# EAGLE design 2022-07-29 LVMi Pressure Sensor - 1624 (EAGLE 9.6.2)
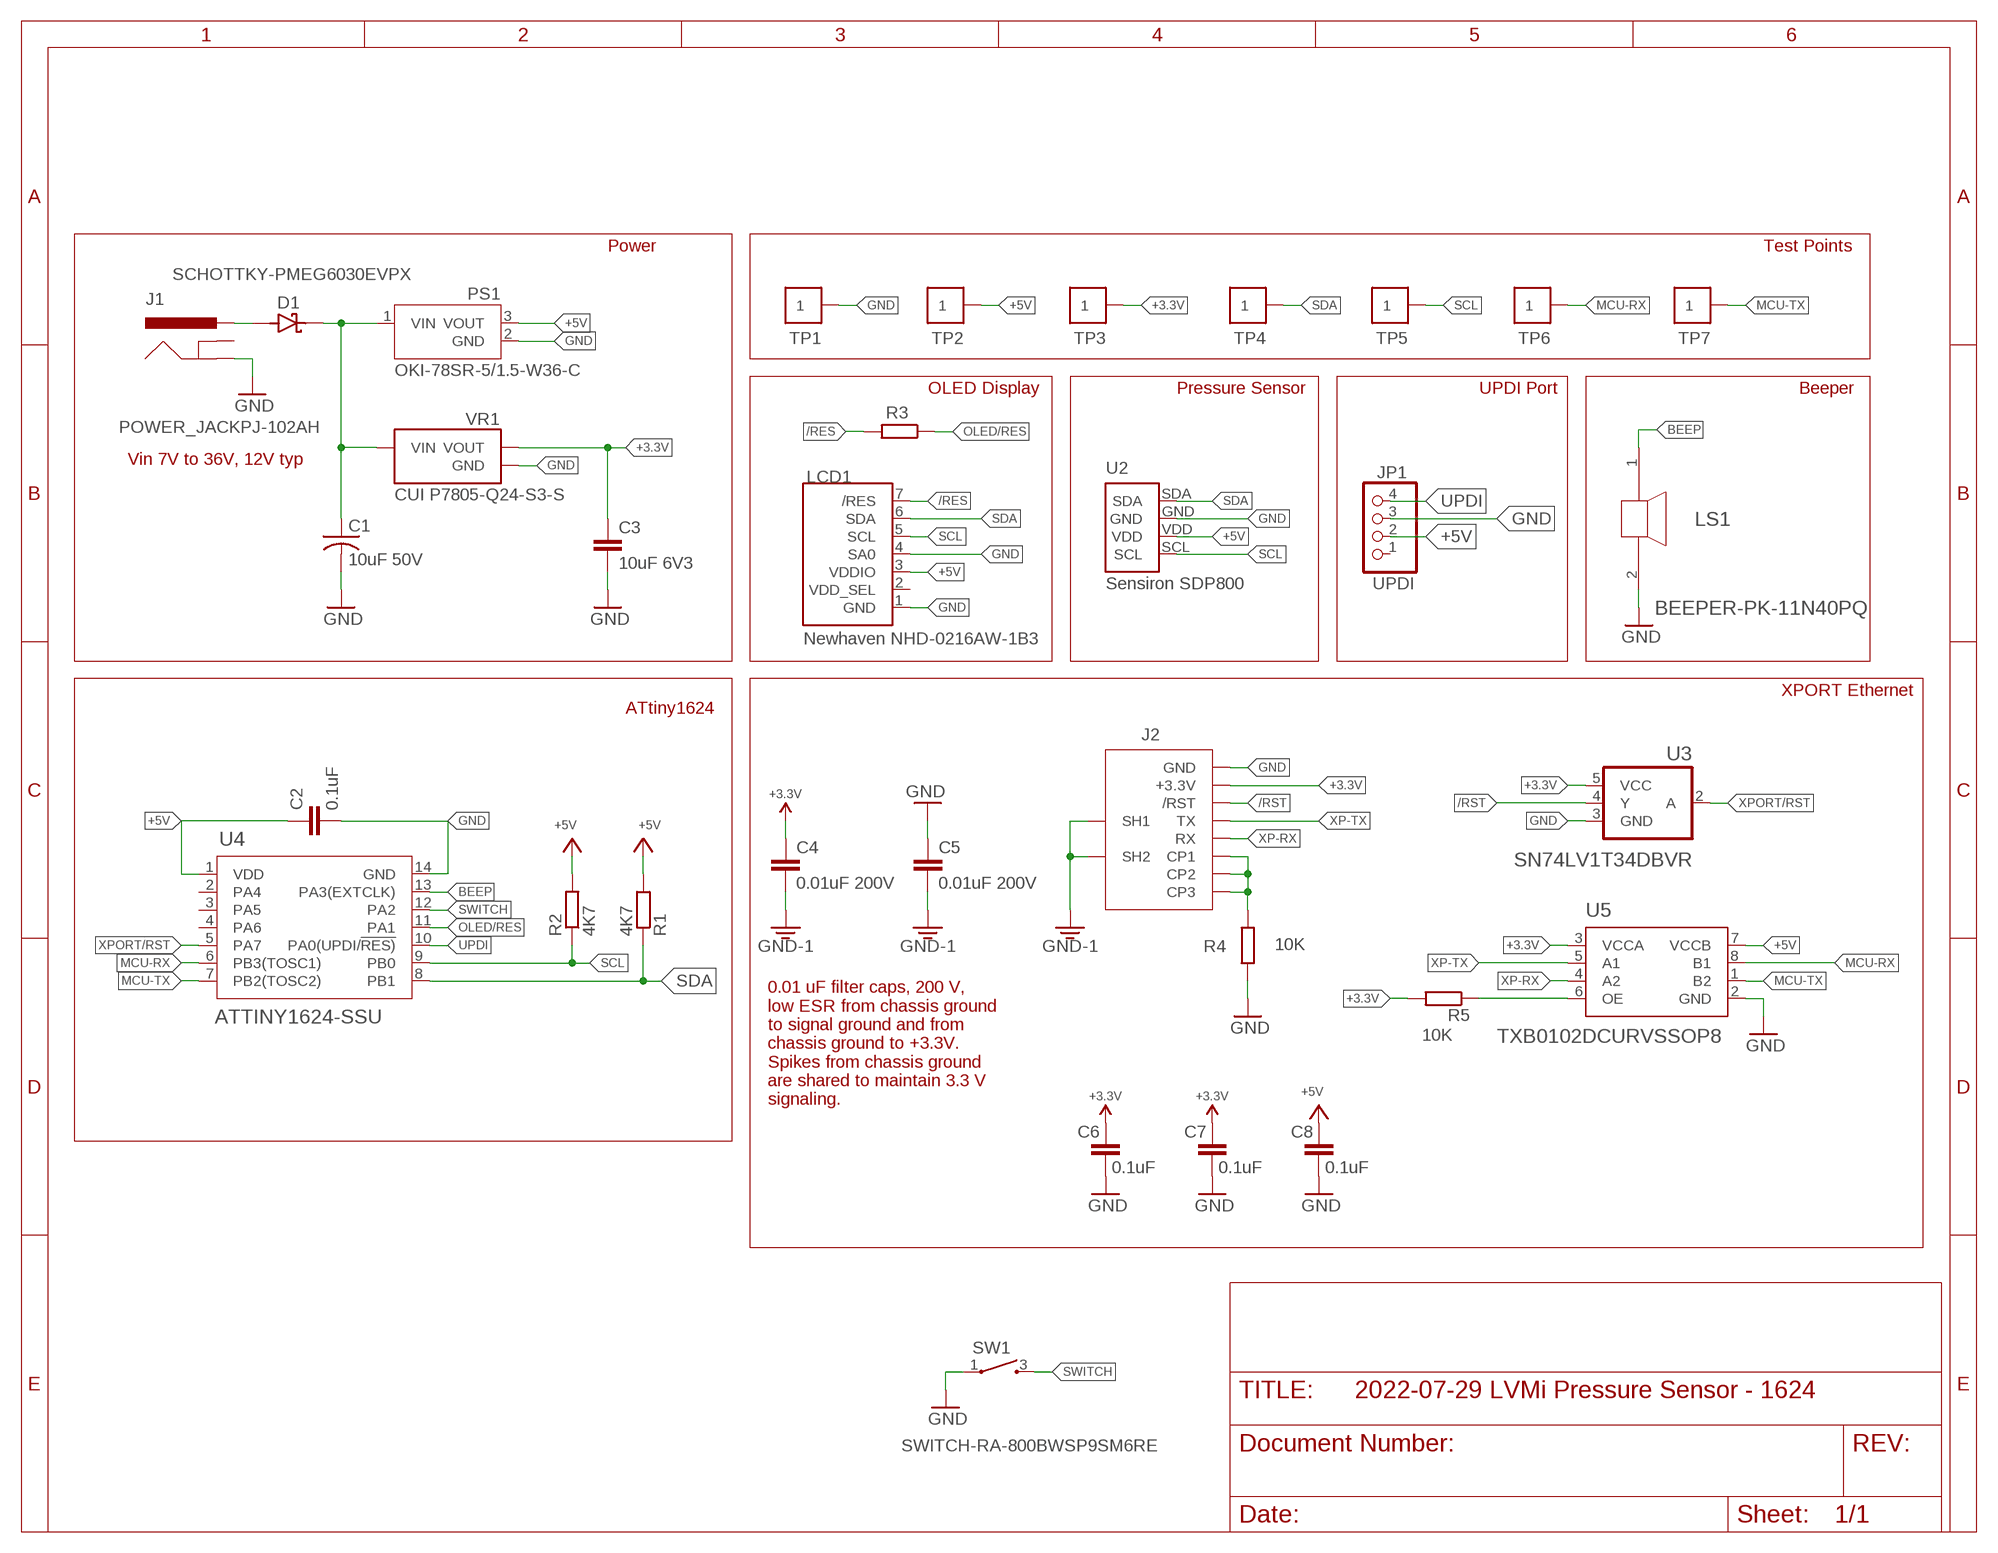
[diagram p0: schematic, sheet 1]

## Parts
C1  10uF 50V  C-USC1210  [C1210]
C2  0.1uF  C-EUC0805  [C0805]
C3  10uF 6V3  C-EUC0805  [C0805]
C4  0.01uF 200V  C-EUC0805  [C0805]
C5  0.01uF 200V  C-EUC0805  [C0805]
C6  0.1uF  C-EUC0805  [C0805]
C7  0.1uF  C-EUC0805  [C0805]
C8  0.1uF  C-EUC0805  [C0805]
D1  SCHOTTKY-PMEG6030EVPX  [DIO_PMEG6030EVPX]
J1  POWER_JACKPJ-102AH  [PJ-102AH]
J2  XPORTXPORT-2  [XPORT-2]
JP1  UPDI  PINHD-1X4/90  [1X04/90]
LCD1  Newhaven NHD-0216AW-1B3  LCD-NEWHAVEN-16X2  [LCD-NEWHAVEN-16X2]
LS1  BEEPER-PK-11N40PQ  [PK-11N40PQ_MAL]
PS1  OKI-78SR-5/1.5-W36-C  [CONV_OKI-78SR-5/1.5-W36-C]
R1  4K7  R-EU_R0805  [R0805]
R2  4K7  R-EU_R0805  [R0805]
R3  R-EU_R0805  [R0805]
R4  10K  R-EU_R0805  [R0805]
R5  10K  R-EU_R0805  [R0805]
SW1  SWITCH-RA-800BWSP9SM6RE  [SWITCH-RA-800BWSP9SM6RE]
TP1  GND  TP5000-TESTPOINT-BLK  [TP5000-TESTPOINT-BLK]
TP2  +5V  TP5000-TESTPOINT-RED  [TP5000-TESTPOINT-RED]
TP3  +3.3V  TP5000-TESTPOINT-PUR  [TP5000-TESTPOINT-PUR]
TP4  SDA  TP5000-TESTPOINT-YEL  [TP5000-TESTPOINT-YEL]
TP5  SCL  TP5000-TESTPOINT-WHI  [TP5000-TESTPOINT-WHI]
TP6  MCU-RX  TP5000-TESTPOINT-WHI  [TP5000-TESTPOINT-WHI]
TP7  MCU-TX  TP5000-TESTPOINT-WHI  [TP5000-TESTPOINT-WHI]
U2  Sensiron SDP800  SDP800_PRESSURE_SENSOR  [SDP800_PRESSURE_SENSOR]
U3  SN74LV1T34DBVR  [SOT95P280X145-5N]
U4  ATTINY1624-SSU  ATTINY1624-SSUSOIC150-14_MCH-M  [SOIC150-14_MCH-M]
U5  TXB0102DCURVSSOP8  [GHI-IC_VSSOP8(TI)]
VR1  CUI P7805-Q24-S3-S  P7805-Q24-S3-S  [CONV_P7805-Q24-S3-S]

## Nets
+3.3V: C3.1 C4.1 C6.2 C7.2 J2.3.3V(+3.3V) R5.2 TP3.P$1 U3.5(VCC) U5.3(VCCA) VR1.VOUT
+5V: C2.1 C8.2 JP1.2 LCD1.3(VDDIO) PS1.3(VOUT) R1.2 R2.2 TP2.P$1 U2.VDD U4.1(VDD) U5.7(VCCB)
/RES: LCD1.7(/RES) R3.2
/RST: J2./RST U3.4(Y)
BEEP: LS1.1 U4.13(PA3(EXTCLK))
GND: C1.2 C2.2 C3.2 C5.1 C6.1 C7.1 C8.1 J1.GND J2.GND JP1.3 LCD1.1(GND) LCD1.4(SA0) LS1.2 PS1.2(GND) R4.2 SW1.1 TP1.P$1 U2.GND U3.3(GND) U4.14(GND) U5.2(GND) VR1.GND
GND-1: C4.2 C5.2 J2.P$1(SH1) J2.P$2(SH2)
MCU-RX: TP6.P$1 U4.6(PB3(TOSC1)) U5.8(B1)
MCU-TX: TP7.P$1 U4.7(PB2(TOSC2)) U5.1(B2)
OE: R5.1 U5.6(OE)
OLED/RES: R3.1 U4.11(PA1)
SCL: LCD1.5(SCL) R2.1 TP5.P$1 U2.SCL U4.9(PB0)
SDA: LCD1.6(SDA) R1.1 TP4.P$1 U2.SDA U4.8(PB1)
SWITCH: SW1.3 U4.12(PA2)
UPDI: JP1.4 U4.10(PA0(UPDI/!RES))
VIN: C1.1 D1.1(K) PS1.1(VIN) VR1.VIN
VSUP: D1.2(A) J1.PWR
XP-CP: J2.CP1 J2.CP2 J2.CP3 R4.1
XP-RX: J2.RX U5.4(A2)
XP-TX: J2.TX U5.5(A1)
XPORT/RST: U3.2(A) U4.5(PA7)
Unconnected: J1.GNDBRK(GNDBREAK) JP1.1 LCD1.2(VDD_SEL) U4.2(PA4) U4.3(PA5) U4.4(PA6)

## Notes on the sheet
- Power | Test Points
- OLED Display | Pressure Sensor | UPDI Port | Beeper
- Vin 7V to 36V, 12V typ
- XPORT Ethernet
- ATtiny1624
- 0.01 uF filter caps, 200 V,
  low ESR from chassis ground
  to signal ground and from
  chassis ground to +3.3V.
  Spikes from chassis ground
  are shared to maintain 3.3 V
  signaling.

## Library data of the parts
C1 = AUmlib:C-US: CAPACITOR, American symbol; SPICEPREFIX: C
C2-C8 = AUmlib:C-EU: CAPACITOR, European symbol; SPICEPREFIX: C
D1 = AUmlib:SCHOTTKY-PMEG6030EVPX: PMEG6030 Series 60 V 3 A Surface Mount Schottky Barrier Rectifier - SOD-128; DESCRIPTION: Diode Schottky 60V 3A Surface Mount SOD-128/CFP5; DIGI-KEY_PART_NUMBER: 1727-1349-1-ND; MF: Nexperia USA; MP: PMEG6030EVPX; PACKAGE: CFP5-2 Nexperia USA Inc.; PURCHASE-URL: https://pricing.snapeda.com/search/part/PMEG6030EVPX/?ref=eda
J1 = AUmlib:POWER_JACK: Power Jack Connector The CUI PJ-102AH has smaller tabs and a 2.1 mm opening for a 2.0 mm pin. This is the standard 5.5mm barrel jack for power. The PTH is the most common, proven, reliable, footprint. The Slot footprint only works if the mill layer is transmitted to the PCB fab house so be warned. Here are the connectors we sell at SparkFun: DC Barrel Power Jack/Connector <https://www.sparkfun.com/products/119> (PRT-00119) DC Barrel Power Jack/Connector (SMD) <https://www.sparkfun.com/products/12748> (PRT-12748) DC Barrel Jack Adapter - Breadboard Compatible <https://www.sparkfun.com/products/10811> (PRT-10811) It is used on this SparkFun product (and many, many others): SparkFun RedBoard - Programmed with Arduino <https://www.sparkfun.com/products/12757> (DEV-12757) Also, if you need a mating power supply or connector, please check these out: Wall Adapter Power Supply - 9VDC 650mA <https://www.sparkfun.com/products/298> (TOL-00298) DC Barrel Jack Adapter - Male <https://www.sparkfun.com/products/10287> (PRT-10287)
J2 = AUmlib:XPORT
JP1 = AUmlib:PINHD-1X4: PIN HEADER
LCD1 = AUmlib:LCD-NEWHAVEN-16X2: Newhaven I2C LCD 16x2
LS1 = AUmlib:BEEPER-PK-11N40PQ; COPYRIGHT: Copyright (C) 2022 Ultra Librarian. All rights reserved.; DIGI-KEY_PART_NUMBER_1: 458-1342-ND; MANUFACTURER_PART_NUMBER: PK-11N40PQ; MFR_NAME: Mallory Sonalert
PS1 = AUmlib:OKI-78SR-5/1.5-W36-C: OKI Series 8 W Single Output 5 V Non Isolated Through Hole DC/DC Converter; DESCRIPTION: Linear Regulator Replacement DC DC Converter 1 Output 5V 1.5A 7V - 36V Input; DIGI-KEY_PART_NUMBER: 811-2196-5-ND; MF: Murata Power Solutions Inc.; MP: OKI-78SR-5/1.5-W36-C; PACKAGE: SIP-3 Murata Power; PURCHASE-URL: https://pricing.snapeda.com/search/part/OKI-78SR-5/1.5-W36-C/?ref=eda
R1-R5 = AUmlib:R-EU_: RESISTOR, European symbol; SPICEPREFIX: R
SW1 = AUmlib:SWITCH-RA-800BWSP9SM6RE: Surface mount pushbutton right angle momentary on switch
TP1 = AUmlib:TP5000-TESTPOINT-BLK
TP2 = AUmlib:TP5000-TESTPOINT-RED
TP3 = AUmlib:TP5000-TESTPOINT-PUR
TP4 = AUmlib:TP5000-TESTPOINT-YEL
TP5-TP7 = AUmlib:TP5000-TESTPOINT-WHI
U2 = AUmlib:SDP800_PRESSURE_SENSOR: SDP800 Differential Pressure Sensor
U3 = AUmlib:SN74LV1T34DBVR; DESCRIPTION: Single Power Supply BUFFER Logic Level Shifter (no enable) 5-SOT-23 -40 to 125; DIGI-KEY_PART_NUMBER: 296-37176-1-ND; MF: Texas Instruments; MP: SN74LV1T34DBVR; PACKAGE: SOT-23-5 Texas Instruments; PURCHASE-URL: https://pricing.snapeda.com/search/part/SN74LV1T34DBVR/?ref=eda
U4 = AUmlib:ATTINY1624-SSU; COPYRIGHT: Copyright (C) 2022 Ultra Librarian. All rights reserved.; DIGI-KEY_PART_NUMBER_1: 150-ATTINY1624-SSU-ND; MANUFACTURER_PART_NUMBER: ATTINY1624-SSU; MFR_NAME: Microchip
U5 = AUmlib:TXB0102DCUR: Bidirectional voltage level translator. Digikey 296-22862-1-ND $0.71 each 2020-10-19
VR1 = AUmlib:P7805-Q24-S3-S: CUI P7805-Q24-S3-S DC-DC Converter 3.3V 2W Digikey 102-2704-ND $4.94 2020-09-14; AVAILABILITY: Good; DESCRIPTION: 3.3V 2W; MF: CUI; MP: P7805-Q12-S1R5-S; PACKAGE: SIP-3 CUI; PRICE: $4.94

## Board
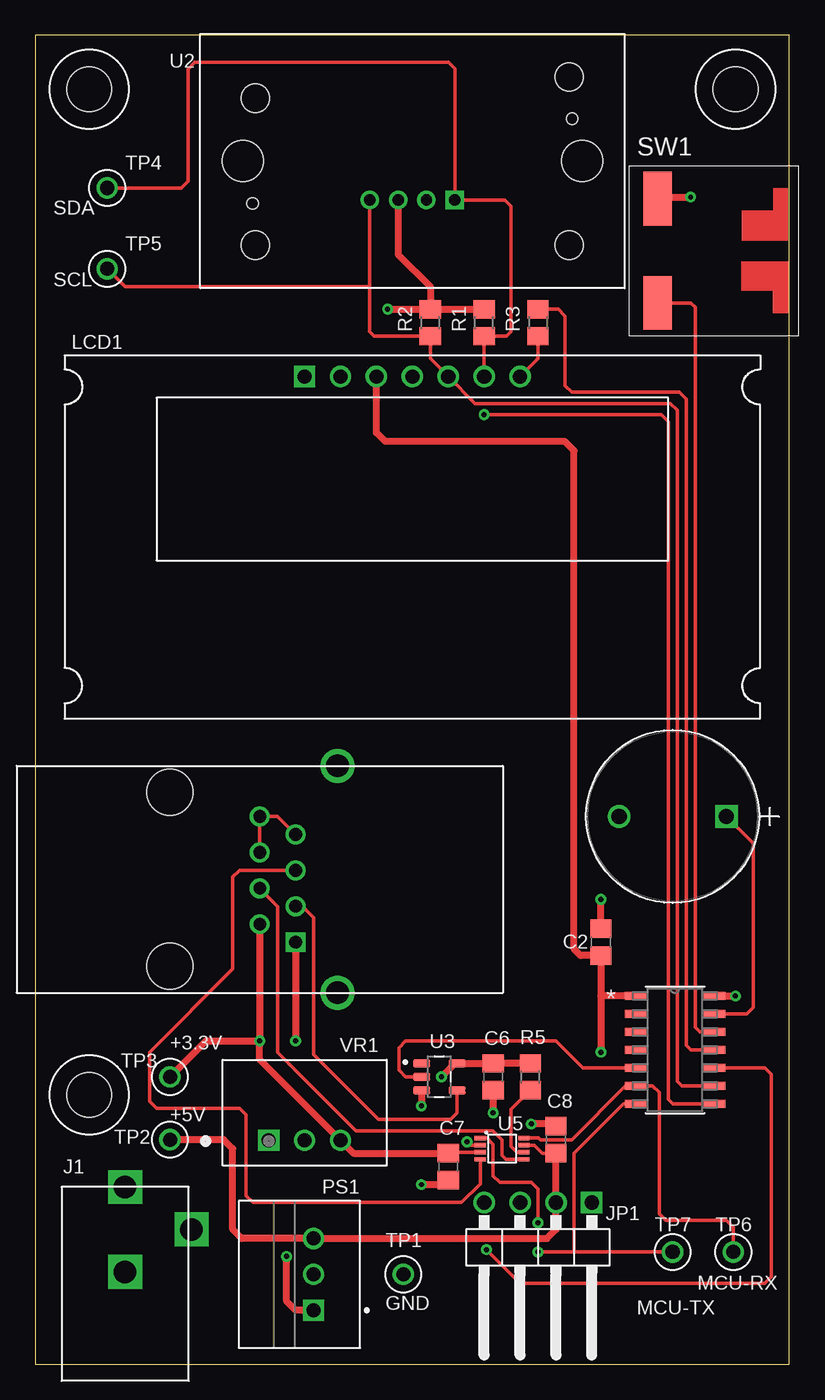
[diagram p1: board, top side]
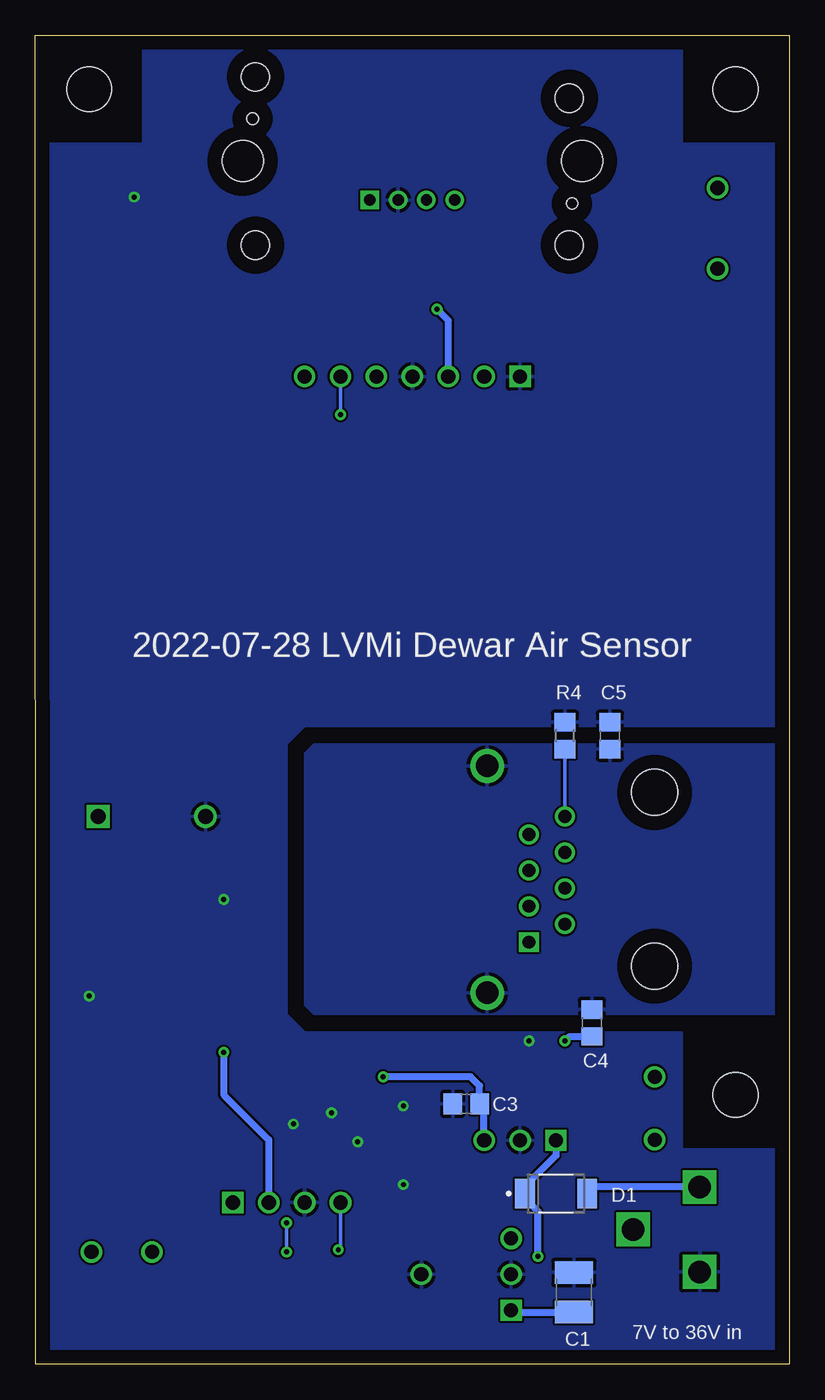
[diagram p2: board, bottom side, seen from below]

Size 53.34 x 93.98 mm. Coordinates in mm from the lower left corner, seen from the top.
Outline: 0,0 53.32,0 53.34,93.98 0,93.98 0,0
Copper layers (1*16): Top 0.035mm / dielectric 1.5mm / Bottom 0.035mm
Design rules "default": minimum track width 6mil, minimum drill 0.35mm, track to track 6mil, track to pad 6mil, pad to pad 6mil, via to via 6mil, smd to smd 6mil, copper to edge 40mil, drill to drill 6mil, minimum pad ring 10mil, minimum via ring 8mil, stop-mask expansion 4mil, vias tented up to drill 0mil, thermal gap 10mil
Holes 3.17 mm at 3.81,90.17 49.53,90.17 3.81,19.05

### Footprints (pad centres in the part's own frame; a part is rotated, then mirrored left to right if it is on the bottom)
C1210 = smd 1.6 x 2.7: 1 -1.4,0; 2 1.4,0
C0805 = smd 1.3 x 1.5: 1 -0.95,0; 2 0.95,0
DIO_PMEG6030EVPX = smd 1.4 x 2.1: 1 -2.2,0; 2 2.2,0
PJ-102AH = drill 1.6 square: GND 0,3; GNDBRK -4.7,0; PWR 0,-3
XPORT-2 = drill 0.9: 3.3V 0,-3.175; /RST 2.54,-1.905; CP1 0,1.905; CP2 2.54,3.175; CP3 0,4.445; RX 2.54,0.635; TX 0,-0.635 | drill 0.9 square: GND 2.54,-4.445 | drill 1.6: P$1 5.5,8.025; P$2 5.5,-8.025 | hole 3.25: -6.35,6.15; -6.35,-6.15
1X04/90 = drill 1.016 square: 1 -3.81,-3.81 | drill 1.016: 2 -1.27,-3.81; 3 1.27,-3.81; 4 3.81,-3.81
LCD-NEWHAVEN-16X2 = drill 1 square: 1 -7.62,0 | drill 1: 2 -5.08,0; 3 -2.54,0; 4 0,0; 5 2.54,0; 6 5.08,0; 7 7.62,0
PK-11N40PQ_MAL = drill 1.067 pad 1.575 square: 1 0,0 | drill 1.067 pad 1.575: 2 7.595,0
CONV_OKI-78SR-5/1.5-W36-C = drill 1 pad 1.5 square: 1 -2.54,0 | drill 1 pad 1.5: 2 0,0; 3 2.54,0
R0805 = smd 1.3 x 1.5: 1 -0.95,0; 2 0.95,0
SWITCH-RA-800BWSP9SM6RE = smd 2.03 x 3.81: 1 2.97,-3.685; 3 2.97,3.685
TP5000-TESTPOINT-BLK = drill 1: P$1 0,0
TP5000-TESTPOINT-RED = drill 1: P$1 0,0
TP5000-TESTPOINT-PUR = drill 1: P$1 0,0
TP5000-TESTPOINT-YEL = drill 1: P$1 0,0
TP5000-TESTPOINT-WHI = drill 1: P$1 0,0
SDP800_PRESSURE_SENSOR = drill 0.8: GND 1,-2.75; SCL -3,-2.75; VDD -1,-2.75 | drill 0.8 square: SDA 3,-2.75 | hole 2.9: -12,0; 12,0 | hole 2: 11.1,5.95; -11.1,4.45; -11.1,-5.95; 11.1,-5.95 | hole 0.8: -11.3,-3; 11.3,3
SOT95P280X145-5N = smd 1.21 x 0.59: 1 -1.255,0.95; 2 -1.255,0; 3 -1.255,-0.95; 4 1.255,-0.95; 5 1.255,0.95
SOIC150-14_MCH-M = smd 1.6 x 0.559: 1 -2.756,3.81; 2 -2.756,2.54; 3 -2.756,1.27; 4 -2.756,0; 5 -2.756,-1.27; 6 -2.756,-2.54; 7 -2.756,-3.81; 8 2.756,-3.81; 9 2.756,-2.54; 10 2.756,-1.27; 11 2.756,0; 12 2.756,1.27; 13 2.756,2.54; 14 2.756,3.81
GHI-IC_VSSOP8(TI) = smd 0.8 x 0.3: 1 -1.55,0.75; 2 -1.55,0.25; 3 -1.55,-0.25; 4 -1.55,-0.75; 5 1.55,-0.75; 6 1.55,-0.25; 7 1.55,0.25; 8 1.55,0.75
CONV_P7805-Q24-S3-S = drill 1: GND 0,-1.95; VOUT 2.54,-1.95 | drill 1 square: VIN -2.54,-1.95

### Placement (x,y rotation side)
C1  15.24,5.08 90 bottom
C2  40.01,29.84 90 top
C3  22.86,18.41 180 bottom
C4  13.97,24.13 90 bottom
C5  12.7,44.45 270 bottom
C6  32.38,20.32 90 top
C7  29.21,13.97 90 top
C8  36.83,15.88 270 top
D1  16.51,12.06 0 bottom
J1  6.35,9.53 180 top
J2  15.88,34.29 0 top
JP1  35.56,7.62 180 top
LCD1  26.67,69.85 0 top
LS1  48.9,38.73 180 top
PS1  19.68,6.35 90 top
R1  31.75,73.66 90 top
R2  27.94,73.66 90 top
R3  35.56,73.66 270 top
R4  15.88,44.45 90 bottom
R5  35.02,20.32 90 top
SW1  46.99,78.74 180 top
TP1  26.04,6.35 0 top
TP2  9.53,15.88 0 top
TP3  9.53,20.32 0 top
TP4  5.08,83.19 0 top
TP5  5.08,77.47 0 top
TP6  49.37,7.94 0 top
TP7  45.09,7.94 0 top
U2  26.67,85.09 0 top
U3  28.57,20.32 0 top
U4  45.24,22.23 0 top
U5  33.02,15.24 0 top
VR1  19.05,17.78 0 top

### Tracks (layer width: path | path; a pad name or v marks a point on that pad's centre or on a via)
+3.3V  (via drill 0.35)
  Top 0.254: C7.2 29.28,14.99 U5.3
  Top 0.508: TP3.P$1 12.06,22.86 v15.88,22.86 | J2.3.3V v15.88,22.86 | v15.88,22.86 15.88,21.55 VR1.VOUT 22.5,14.92 C7.2 | R5.2 C6.2 U3.5 29.68,21.27 v28.73,20.32
  Bottom 0.508: v15.88,22.86 15.55,23.18 C4.1 | VR1.VOUT 21.59,18.09 C3.1 21.91,19.69 22.54,20.32 v28.73,20.32
+5V  (via drill 0.35)
  Top 0.254: C8.2 35.88,14.93 35.31,15.49 U5.7 | U5.7
  Top 0.508: TP2.P$1 13.34,15.88 13.97,15.24 13.97,9.53 14.61,8.89 PS1.3 36.2,8.89 36.83,9.53 JP1.2 C8.2 | v24.92,74.61 v24.93,74.61 R2.2 | U2.VDD 25.67,78.47 27.94,76.2 R2.2 | R2.2 R1.2 | LCD1.3 24.13,65.88 24.76,65.25 37.46,65.25 38.1,64.61 38.1,29.37 38.57,28.89 C2.1 40.01,26.04 | 40.01,26.04 v40.01,22.07 | U4.1 40.01,26.04
  Bottom 0.508: LCD1.3 24.13,73.82 v24.92,74.61 | JP1.2 36.83,15.88 40.01,19.05 v40.01,22.07
/RES
  Top 0.254: R3.2 35.56,71.12 LCD1.7
/RST
  Top 0.254: U3.4 29.84,19.36 29.84,17.78 29.37,17.3 24.29,17.3 19.68,21.91 19.68,31.59 18.89,32.38 J2./RST
BEEP
  Top 0.254: LS1.1 50.8,36.83 50.8,25.24 50.32,24.77 U4.13
GND  (via drill 0.35)
  Top 0.254: U5.2 30.86,15.49 30.64,15.72 v30.54,15.72
  Top 0.508: J2.GND v18.41,22.86 | SW1.1 44.15,82.55 v46.35,82.55 | C6.1 v32.38,17.78 | C8.1 36.67,16.99 v35.08,16.99 | C7.1 28.89,12.7 v27.3,12.7 | U3.3 27.32,18.27 v27.3,18.26 | U4.14 v49.53,26.04 | C2.2 v40.01,32.86
  pour Bottom: 0,0 53.34,0 53.34,86.36 45.72,86.36 45.72,93.98 7.62,93.98 7.62,86.36 0,86.36 0,45.09 34.29,45.09 35.56,43.81 35.56,24.77 34.29,23.5 7.62,23.5 7.62,15.24 0,15.24
GND-1
  pour Bottom: 0,43.81 33.66,43.81 34.29,43.18 34.29,25.4 33.66,24.77 0,24.77
MCU-RX
  Top 0.254: TP6.P$1 49.37,9.68 48.9,10.16 44.61,10.16 44.13,10.64 44.13,19.21 43.66,19.68 U4.6 41.75,19.68 37.94,15.88 35.72,15.88 35.6,15.99 U5.8
MCU-TX  (via drill 0.35)
  Top 0.254: TP7.P$1 38.1,7.94 | 38.1,7.94 v35.56,7.94 | 38.1,7.94 38.1,14.92 41.59,18.41 U4.7 | v35.56,10 35.56,12.38 35.08,12.86 32.86,12.86 32.38,13.34 32.38,15.56 31.95,15.99 U5.1
  Bottom 0.254: v35.56,7.94 v35.56,10
OE
  Top 0.254: R5.1 33.66,18 33.66,15.4 34.06,14.99 U5.6
OLED/RES
  Top 0.254: R3.1 36.99,74.61 37.47,74.14 37.47,69.22 37.94,68.74 45.56,68.74 46.04,68.26 46.04,22.54 46.35,22.23 U4.11
SCL
  Top 0.254: 23.65,76.2 23.65,73.03 23.97,72.71 R2.1 27.94,71.12 LCD1.5 31.11,67.94 44.93,67.94 45.4,67.47 45.4,20 45.72,19.68 U4.9 | 23.65,76.2 23.65,82.32 U2.SCL | TP5.P$1 6.35,76.2 23.65,76.2
SDA  (via drill 0.35)
  Top 0.254: TP4.P$1 10.32,83.19 10.79,83.66 10.79,91.6 11.27,92.08 29.21,92.08 29.67,91.61 U2.SDA 33.23,82.34 33.66,81.92 33.66,73.03 33.34,72.71 R1.1 LCD1.6 | v31.75,67.15 44.29,67.15 44.77,66.67 44.77,18.73 45.09,18.41 U4.8
  Bottom 0.254: v31.75,67.15 LCD1.6
SWITCH
  Top 0.254: SW1.3 46.39,75.06 46.67,74.77 46.67,23.81 46.99,23.5 U4.12
UPDI  (via drill 0.35)
  Top 0.254: v31.91,8.1 34.29,5.71 51.59,5.71 52.07,6.19 52.07,20.48 51.59,20.95 U4.10
  Bottom 0.254: JP1.4 31.75,8.26 v31.91,8.1
VIN  (via drill 0.35)
  Top 0.508: PS1.1 18.41,3.81 17.78,4.45 v17.78,7.62
  Bottom 0.508: PS1.1 19.55,3.68 C1.1 | VR1.VIN 16.51,14.76 18.71,12.56 D1.1 18.71,11.72 17.78,10.79 v17.78,7.62
VSUP
  Bottom 0.508: J1.PWR 13.79,12.53 13.97,12.7 14.31,12.36 D1.2
XP-CP
  Top 0.254: J2.CP1 J2.CP3 17.14,38.73 J2.CP2
  Bottom 0.254: J2.CP3 R4.1
XP-RX
  Top 0.254: J2.RX 14.45,34.92 13.97,34.45 13.97,27.94 8.1,22.07 8.1,18.57 8.57,18.1 14.45,18.1 14.92,17.62 14.92,11.91 15.4,11.43 30.16,11.43 31.5,12.76 31.5,14.46 U5.4
XP-TX
  Top 0.254: J2.TX 17.14,32.38 17.14,22.07 22.7,16.51 32.38,16.51 33.02,15.88 33.02,14.76 33.29,14.49 U5.5
XPORT/RST
  Top 0.254: U3.2 26.19,20.32 25.72,20.8 25.72,22.38 26.19,22.86 36.83,22.86 38.73,20.95 U4.5

### Text on the board
bPlace: 2022-07-28 LVMi Dewar Air Sensor | 7V to 36V in